# EAGLE design ahrs (EAGLE 6.4)
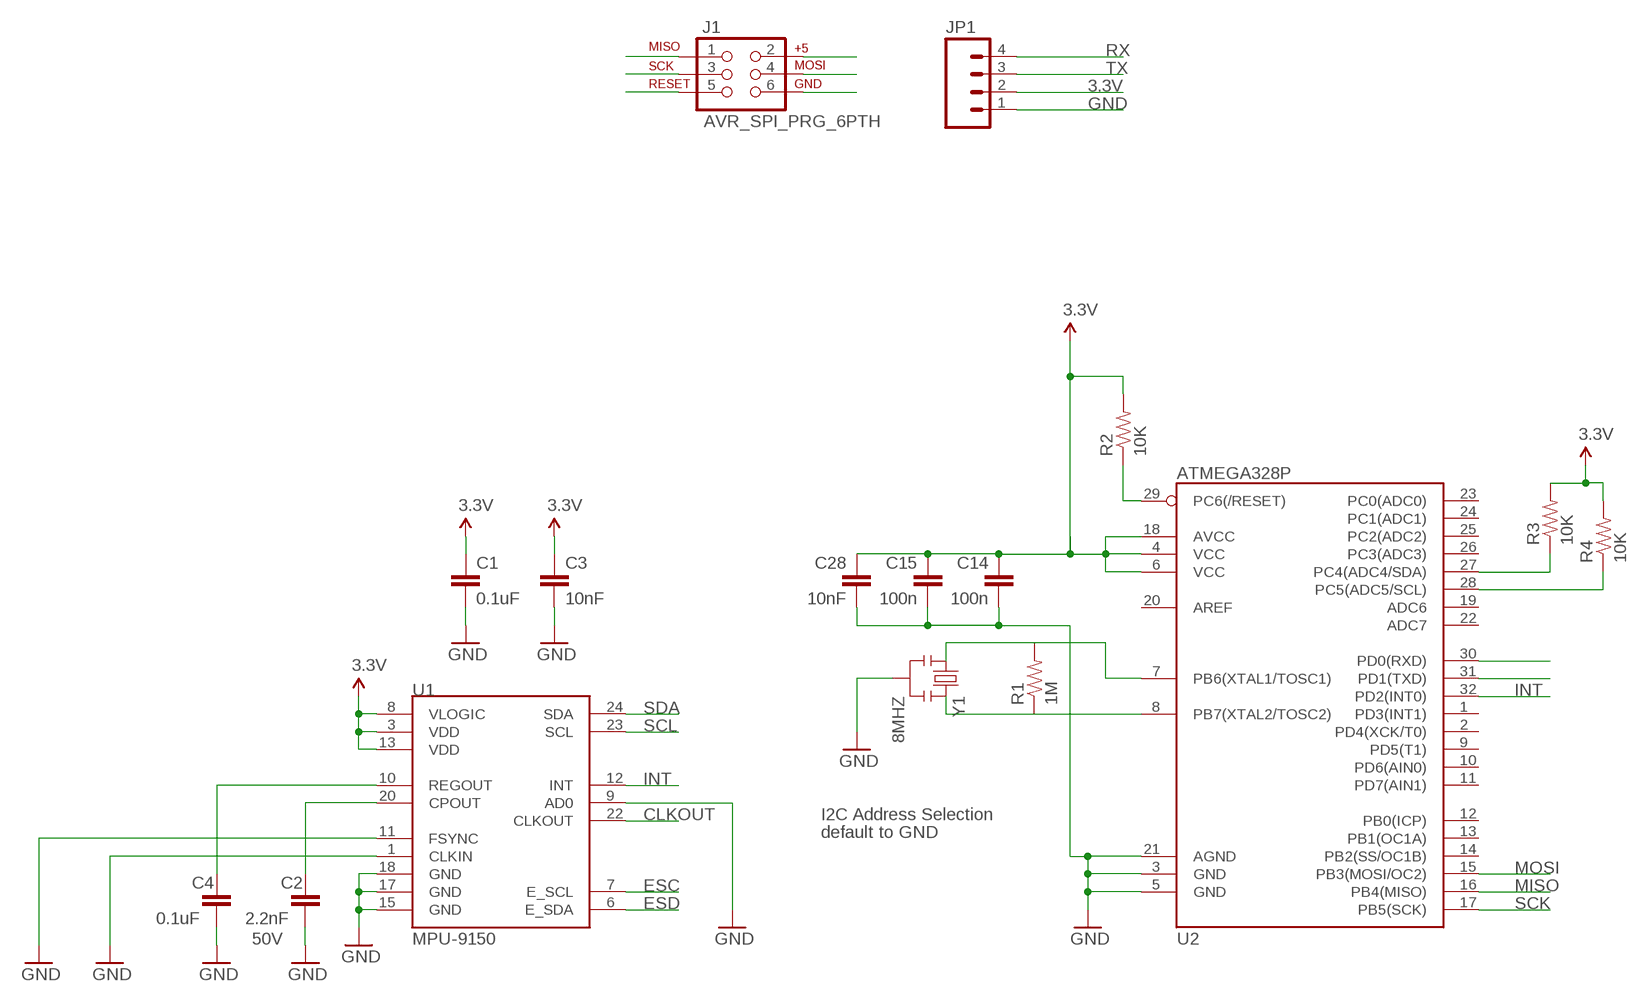
[diagram p0: schematic, sheet 1]

## Parts
C1  0.1uF  CAP0603-CAP  [0603-CAP]
C2  2.2nF  CAP0603-CAP  [0603-CAP]
C3  10nF  CAP0603-CAP  [0603-CAP]
C4  0.1uF  CAP0603-CAP  [0603-CAP]
C14  100n  C-EU0603-RND  [C0603-ROUND]
C15  100n  C-EU0603-RND  [C0603-ROUND]
C28  10nF  CAP0603-CAP  [0603-CAP]
J1  AVR_SPI_PRG_6PTH  [2X3]
JP1  M04PTH  [1X04]
R1  1M  RESISTOR0603-RES  [0603-RES]
R2  10K  RESISTOR0603-RES  [0603-RES]
R3  10K  RESISTOR0603-RES  [0603-RES]
R4  10K  RESISTOR0603-RES  [0603-RES]
U1  MPU-9150  MPU-9150QFN-24-NP  [QFN-24-NP]
U2  ATMEGA328P  ATMEGA328_SMT  [TQFP32-08]
Y1  8MHZ  RESONATOR8MHZ  [RESONATOR-SMD]

## Nets
3.3V: C1.1 C3.1 C14.1 C15.1 C28.1 J1.2 JP1.2 R2.2 R3.2 R4.2 U1.3(VDD) U1.8(VLOGIC) U1.13(VDD) U2.4(VCC) U2.6(VCC) U2.18(AVCC)
CLKOUT: U1.22(CLKOUT)
ESC: U1.7(E_SCL)
ESD: U1.6(E_SDA)
GND: C1.2 C2.2 C3.2 C4.2 C14.2 C15.2 C28.2 J1.6 JP1.1 U1.1(CLKIN) U1.9(AD0) U1.11(FSYNC) U1.15(GND) U1.17(GND) U1.18(GND) U2.3(GND) U2.5(GND) U2.21(AGND) Y1.2
INT: U1.12(INT) U2.32(PD2(INT0))
MISO: J1.1 U2.16(PB4(MISO))
MOSI: J1.4 U2.15(PB3(MOSI/OC2))
N$1: C2.1 U1.20(CPOUT)
N$2: C4.1 U1.10(REGOUT)
N$7: R1.2 U2.7(PB6(XTAL1/TOSC1)) Y1.1
N$8: R1.1 U2.8(PB7(XTAL2/TOSC2)) Y1.3
RESET: J1.5 R2.1 U2.29(PC6(/RESET))
RX: JP1.4 U2.30(PD0(RXD))
SCK: J1.3 U2.17(PB5(SCK))
SCL: R4.1 U1.23(SCL) U2.28(PC5(ADC5/SCL))
SDA: R3.1 U1.24(SDA) U2.27(PC4(ADC4/SDA))
TX: JP1.3 U2.31(PD1(TXD))
Unconnected: U2.1(PD3(INT1)) U2.2(PD4(XCK/T0)) U2.9(PD5(T1)) U2.10(PD6(AIN0)) U2.11(PD7(AIN1)) U2.12(PB0(ICP)) U2.13(PB1(OC1A)) U2.14(PB2(SS/OC1B)) U2.19(ADC6) U2.20(AREF) U2.22(ADC7) U2.23(PC0(ADC0)) U2.24(PC1(ADC1)) U2.25(PC2(ADC2)) U2.26(PC3(ADC3))

## Notes on the sheet
- I2C Address Selection
- default to GND
- 50V

## Library data of the parts
C1-C4 C28 = SparkFun-Passives:CAP: Capacitor Standard 0603 ceramic capacitor, and 0.1" leaded capacitor.
C14 C15 = SmartPrj:C-EU: CAPACITOR, European symbol
J1 = SparkFun-Connectors:AVR_SPI_PRG_6: AVR ISP 6 Pin This is the reduced ISP connector for AVR programming. Common on Arduino. This footprint will take up less PCB space and can be used with a 10-pin to 6-pin adapter such as SKU: BOB-08508
JP1 = SparkFun-Connectors:M04: Header 4 Standard 4-pin 0.1" header. Use with straight break away headers (SKU : PRT-00116), right angle break away headers (PRT-00553), swiss pins (PRT-00743), machine pins (PRT-00117), and female headers (PRT-00115). Molex polarized connector foot print use with SKU : PRT-08231 with associated crimp pins and housings. 1MM SMD Version SKU: PRT-10208
R1-R4 = SparkFun-Resistors:RESISTOR: Resistor Basic schematic elements and footprints for 0603, 1206, and PTH resistors.
U1 = SparkFun-Sensors:MPU-9150: 9DOF (3mag, 3accel, 3rotat). I2C interface.
U2 = SparkFun-DigitalIC:ATMEGA328_SMT: 32-Pin Atmega328 part Commonly used on Arduino compatible boards Available in QFP and QFN packages TQFP is IC-09069 QFN is non-stock; PROD_ID: IC-09069
Y1 = SparkFun-FreqCtrl:RESONATOR: Resonator Small SMD resonator. Used, eg, on the Arduino Pro/ Pro Mini boards. 8MHz- XTAL-08895 16MHz- XTAL-08900; PROD_ID: XTAL-08895

## Net classes
0 default: width 0.203 mm, drill 0.406 mm, clearance 0.203 mm
2 gnd: width 0.305 mm, drill 0.406 mm, clearance 0.203 mm
3 power usb: width 0.508 mm, drill 0.406 mm, clearance 0.203 mm

## Board
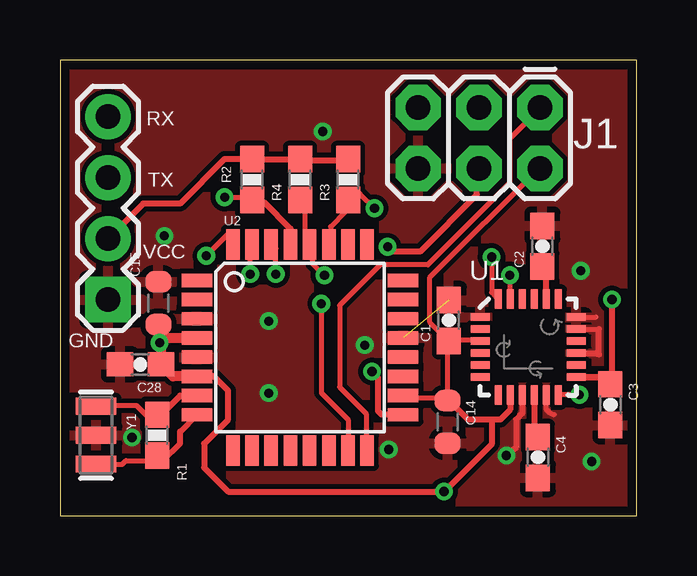
[diagram p1: board, top side]
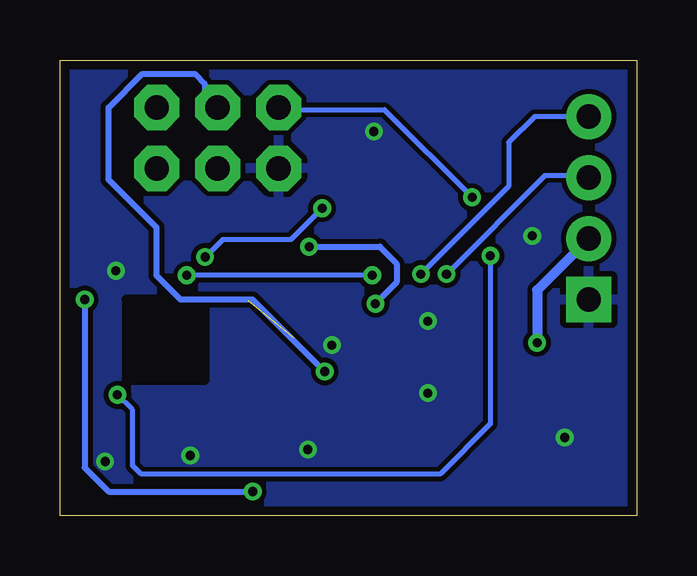
[diagram p2: board, bottom side, seen from below]

Size 24.03 x 18.98 mm. Coordinates in mm from the lower left corner, seen from the top.
Outline: 0,0 24.03,0 24.03,18.98 0,18.98 0,0
Copper layers (1*16): Top 0.0356mm / dielectric 1.5011mm / Bottom 0.0356mm
Design rules "LaenPCBOrder *": minimum track width 6mil, minimum drill 13mil, track to track 6mil, track to pad 6mil, pad to pad 6mil, via to via 6mil, smd to smd 6mil, copper to edge 15mil, drill to drill 6mil, minimum pad ring 7mil, minimum via ring 7mil, stop-mask expansion 3mil, vias tented up to drill 15mil, thermal gap 10mil
tRestrict: area 18.1,5.7 to 20.9,8.4
bRestrict: area 18,5.7 to 21.2,9

### Footprints (pad centres in the part's own frame; a part is rotated, then mirrored left to right if it is on the bottom)
0603-CAP = smd 1.1 x 1: 1 -0.85,0; 2 0.85,0
C0603-ROUND = smd 0.898 x 1.1: 1 -0.889,0; 2 0.889,0
2X3 = drill 1.016 pad 1.88 octagon: 1 0,0; 2 0,2.54; 3 2.54,0; 4 2.54,2.54; 5 5.08,0; 6 5.08,2.54
1X04 = drill 1.016 pad 1.88 square: 1 0,0 | drill 1.016 pad 1.88: 2 2.54,0; 3 5.08,0; 4 7.62,0
0603-RES = smd 1.1 x 1: 1 -0.85,0; 2 0.85,0
QFN-24-NP = smd 0.8 x 0.3: 1 -2,1.25; 2 -2,0.75; 3 -2,0.25; 4 -2,-0.25; 5 -2,-0.75; 6 -2,-1.25; 13 2,-1.25; 14 2,-0.75; 15 2,-0.25; 16 2,0.25; 17 2,0.75; 18 2,1.25 | smd 0.3 x 0.8: 7 -1.25,-2; 8 -0.75,-2; 9 -0.25,-2; 10 0.25,-2; 11 0.75,-2; 12 1.25,-2; 19 1.25,2; 20 0.75,2; 21 0.25,2; 22 -0.25,2; 23 -0.75,2; 24 -1.25,2
TQFP32-08 = smd 1.27 x 0.559: 1 -4.293,2.8; 2 -4.293,2; 3 -4.293,1.2; 4 -4.293,0.4; 5 -4.293,-0.4; 6 -4.293,-1.2; 7 -4.293,-2; 8 -4.293,-2.8; 17 4.293,-2.8; 18 4.293,-2; 19 4.293,-1.2; 20 4.293,-0.4; 21 4.293,0.4; 22 4.293,1.2; 23 4.293,2; 24 4.293,2.8 | smd 0.559 x 1.27: 9 -2.8,-4.293; 10 -2,-4.293; 11 -1.2,-4.293; 12 -0.4,-4.293; 13 0.4,-4.293; 14 1.2,-4.293; 15 2,-4.293; 16 2.8,-4.293; 25 2.8,4.293; 26 2,4.293; 27 1.2,4.293; 28 0.4,4.293; 29 -0.4,4.293; 30 -1.2,4.293; 31 -2,4.293; 32 -2.8,4.293
RESONATOR-SMD = smd 0.7 x 1.7: 1 -1.2,0; 2 0,0; 3 1.2,0

### Placement (x,y rotation side)
C1  16.2,8.13 90 top
C2  20.1,11.22 90 top
C3  22.93,4.62 270 top
C4  19.91,2.42 270 top
C14  16.15,3.9 270 top
C15  4.1,8.85 90 top
C28  3.35,6.3 180 top
J1  20,17 180 top
JP1  2,9 90 top
R1  4.05,3.35 90 top
R2  8,14 90 top
R3  12,14 90 top
R4  10,14 90 top
U1  19.51,7.02 0 top
U2  10,7 0 top
Y1  1.5,3.35 270 top

### Tracks (layer width: path | path; a pad name or v marks a point on that pad's centre or on a via)
3.3V  (via drill 0.38)
  Top 0.203: U2.18 14.33,4.88 16,4.88 C14.1 16.15,4.88 16.15,7.16 C1.1 | 5.64,5.79 U2.6 | 5.64,7.32 U2.4 | 7.92,14.78 R2.2 | U1.3 17.37,7.32 16.31,7.32 C1.1 | 22.71,5.79 21.64,5.79 U1.13 22.77,5.77 23,6 | 22.71,5.79 22.71,5.49 C3.1 22.71,5.79 | C1.1 16.15,7.32 15.39,8.08 15.39,9.91 19.96,14.48 J1.2 | 10.06,14.78 R4.2 | 11.89,14.78 R3.2
  Top 0.254: U1.8 18.76,4.41 18.35,4 18,4 | 18,4 17,4 16.21,4.79 C14.1 | 18,4 18,3 v16,1 7,1 6,2 6,3 7,4 7,5.2 6.4,5.8 U2.6 | 4.2,6.59 C28.1 | C15.1 3.96,8.28 | 11.89,14.78 10.06,14.78 | R4.2 R2.2 6.85,14.85 5,13 3.46,13 JP1.2 | U1.13 23.23,5.77 | 23,6 v23,9
  Top 0.406: 4.35,7.4 v4.15,7.2 4.2,7.15 C28.1 4.7,5.8 U2.6 | 4.35,7.4 U2.4 | 4.35,7.4 4.1,7.65 C15.1
  Bottom 0.254: v16,1 22,1 23,2 v23,9
  Bottom 0.406: JP1.2 4.15,9.39 v4.15,7.2
GND  (via drill 0.38)  (1 unrouted)
  Top 0.203: U1.17 22.45,7.77 22.37,7.72 | U1.18 22.33,8.27 | U1.11 20.27,4.88 20.27,4.42 20.42,4.27 20.6,4.2
  Top 0.254: U1.9 19.26,4.26 19,4 19,2.85 v18.6,2.5 | U1.15 22.38,6.77 22.45,6.7 22.45,7.77
  other vias: 12.7,7.1 8.7,5.1 8.7,8.1 21.7,10.2 10.95,16 3,3.25 13.7,2.75 4.35,11.65 22.15,2.25
  pour Top: 0,0 0,19 25,19 25,0
  pour Bottom: 0,0 0,19 25,19 25,0
INT  (via drill 0.38)
  Top 0.203: v21.64,5.03 20.88,5.03 U1.12 | v6.1,10.82 7.01,11.73 7.16,11.73 7.16,11.43 U2.32
  Bottom 0.203: v21.64,5.03 21,4.4 21,2.08 20.64,1.72 8.19,1.72 6.1,3.82 6.1,3.9 v6.1,10.82
MISO
  Top 0.203: U2.16 12.65,2.74 12.75,2.95 12.75,4.25 11.65,5.35 11.65,8.75 13.34,10.45 15.32,10.45 18.75,13.87 18.75,15.7 19.96,16.92 J1.1
MOSI  (via drill 0.38)
  Top 0.203: v10.89,8.83 10.89,5.11 12,4 12,3 11.89,2.74 U2.15
  Top 0.254: v13.65,11.2 13.8,11 15,11 17.37,13.37 17.37,14.37 J1.4
  Bottom 0.254: v13.65,11.2 10.7,11.2 10,10.5 10,9.71 v10.89,8.83
N$1
  Top 0.254: U1.20 20.26,10.41 C2.1
N$2
  Top 0.254: U1.10 19.76,3.42 C4.1
N$7
  Top 0.203: Y1.1 1.52,4.57 3.2,4.57 3.66,4.12 R1.2
  Top 0.254: R1.2 4,4 5,5 U2.7
N$8
  Top 0.203: R1.1 3.66,2.29 2.74,2.29 2.59,2.13 1.52,2.13 Y1.3
  Top 0.254: R1.1 4.3,2.3 5,3 5,3.49 U2.8
RESET  (via drill 0.38)
  Top 0.203: v6.86,13.26 7.92,13.26 R2.1
  Top 0.254: U2.29 9.6,11.95 8.5,13.05 8.1,13.05 R2.1
  Bottom 0.203: v6.86,13.26 10.52,16.92 14.78,16.92 J1.5
RX  (via drill 0.38)
  Top 0.203: v8.99,10.06 8.99,11.12 8.84,11.28 U2.30
  Bottom 0.203: v8.99,10.06 5.33,13.72 5.33,15.54 4.26,16.62 JP1.4
SCK  (via drill 0.38)
  Top 0.254: U2.17 13.4,4.2 13.25,4.35 13.25,5.75 v13,6
  Bottom 0.254: v13,6 16,9 19,9 20,10 20,12 22,14 22,17 20.6,18.4 18.4,18.4 18,18 18,17.46 J1.3
SCL  (via drill 0.38)
  Top 0.203: v18.75,10.01 18.75,9.14 U1.23 | v11.02,10.01 10.52,10.52 10.52,11.28 U2.28 10.36,11.43 10.21,11.58 10.21,12.95 10.06,13.11 R4.1
  Bottom 0.203: v11.02,10.01 v18.75,10.01
SDA  (via drill 0.38)
  Top 0.203: v17.98,10.77 17.98,9.3 18.14,9.14 U1.24 | v13.11,12.8 12.5,13.41 12.04,13.41 12.04,13.26 R3.1 11.89,13.11 11.89,12.65 11.28,12.04 11.28,11.43 U2.27
  Bottom 0.203: v17.98,10.77 17.26,11.5 14.41,11.5 v13.11,12.8
TX  (via drill 0.38)
  Top 0.203: v7.92,10.06 7.92,11.28 U2.31
  Bottom 0.203: v7.92,10.06 3.81,14.17 2.09,14.17 JP1.3

### Text on the board
tNames: RX | TX | VCC | GND